# Altium schematic sheet AUAV_X05_CAM.SchDoc
size 209 x 148 mm
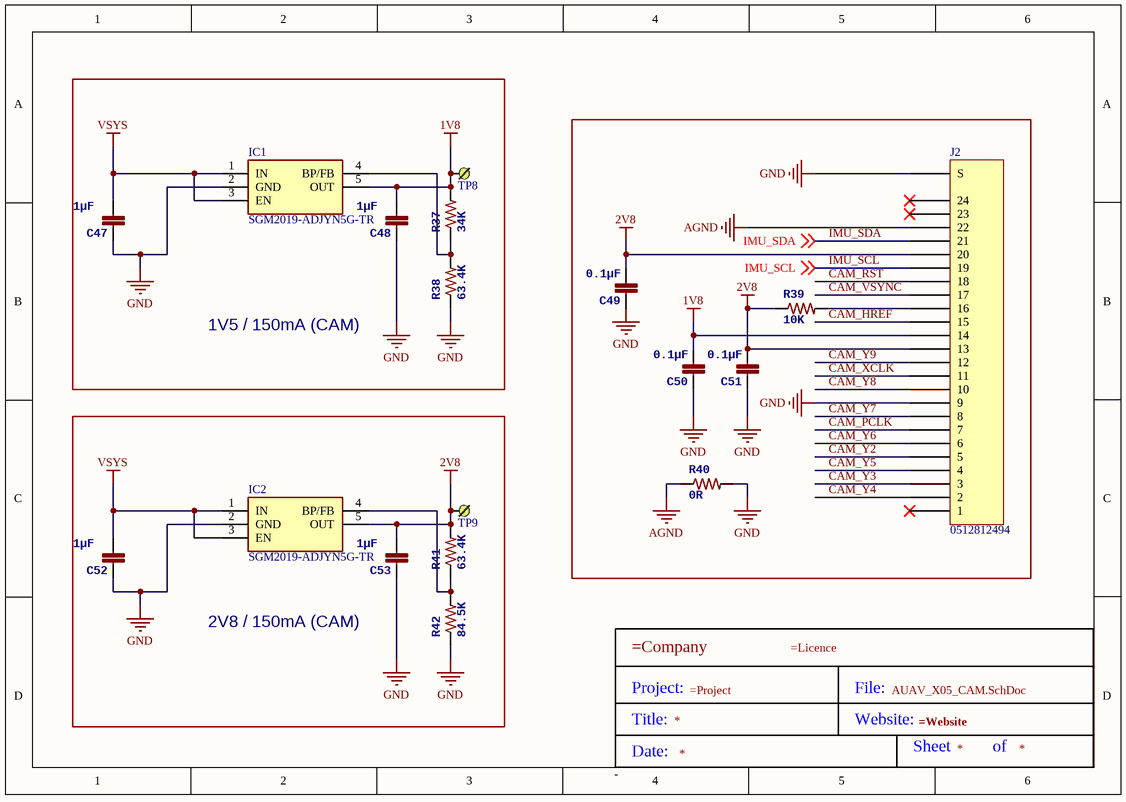
[diagram p0: AUAV_X05_CAM.SchDoc]

## Parts
*?  Title Block  (value not drawn)
C47  1µF  [0402-CAP]
C48  1µF  [0402-CAP]
C49  0.1µF  [0402-CAP]
C50  0.1µF  [0402-CAP]
C51  0.1µF  [0402-CAP]
C52  1µF  [0402-CAP]
C53  1µF  [0402-CAP]
IC1  SGM2019-ADJYN5G-TR  [SOT95P280X125-5N]
IC2  SGM2019-ADJYN5G-TR  [SOT95P280X125-5N]
J2  0512812494  [MOLEX 512812494]
R37  34K  [0402-RES]
R38  63.4K  [0402-RES]
R39  10K  [0402-RES]
R40  0R  [0402-RES]
R41  63.4K  [0402-RES]
R42  84.5K  [0402-RES]
TP8  TP  [SMT_PAD]  (value not drawn)
TP9  TP  [SMT_PAD]  (value not drawn)

## Blocks framed on the sheet
1V5 / 150mA (CAM): C47 C48 IC1 R37 R38 TP8
2V8 / 150mA (CAM): C52 C53 IC2 R41 R42 TP9

## Nets
1V8: C48.P$2 C50.P$2 IC1.5(OUT) J2.14 R37.P$2 TP8.1
2V8: C49.P$2 C51.P$2 C53.P$2 IC2.5(OUT) J2.13 J2.20 R39.P$1 R41.P$2 TP9.1
AGND: J2.22 R40.P$1
GND: C47.P$1 C48.P$1 C49.P$1 C50.P$1 C51.P$1 C52.P$1 C53.P$1 IC1.2(GND) IC2.2(GND) J2.9 J2.S R38.P$1 R40.P$2 R42.P$1
VSYS: C47.P$2 C52.P$2 IC1.1(IN) IC1.3(EN) IC2.1(IN) IC2.3(EN)
CAM_HREF: J2.15
CAM_PCLK: J2.7
CAM_RST: J2.18
CAM_VSYNC: J2.17
CAM_XCLK: J2.11
CAM_Y2: J2.5
CAM_Y3: J2.3
CAM_Y4: J2.2
CAM_Y5: J2.4
CAM_Y6: J2.6
CAM_Y7: J2.8
CAM_Y8: J2.10
CAM_Y9: J2.12
IMU_SCL: J2.19 ; off-sheet IMU_SCL
IMU_SDA: J2.21 ; off-sheet IMU_SDA
NetIC1_4: IC1.4(BP/FB) R37.P$1 R38.P$2
NetIC2_4: IC2.4(BP/FB) R41.P$1 R42.P$2
NetJ2_16: J2.16 R39.P$2

Not connected (* = marked no-connect by the designer): J2 1* 23* 24*

## Notes on the sheet
- (in symbol Title Block) Project:; File:; Title:; Website:; Sheet; of; Date:

## Library data of the parts
C47-C53 = CAP0402: CAP CER 8PF 50V C0G 0402; PARTNO: C1005C0G1H080C; 3DR_PARTNO: ECM0710; Value: 8p; Supplier 1: Digi-Key; Supplier Part Number 1: 445-4890-1-ND
IC1 IC2 = SGM2019-ADJYN5G-TR: Integrated Circuit; Manufacturer_Name: SGMICRO; Height: 1.25mm; Manufacturer_Part_Number: SGM2019-ADJYN5G-TR
J2 = 0512812494: CONN FFC FPC 24POS 0.50MM R/A; Manufacturer: Molex; Cable End Type: Straight, Tapered; Connector/Contact Type: Contacts, Top and Bottom; FFC, FCB Thickness: 0.30mm; Flat Flex Type: FFC, FPC; Material Flammability Rating: UL94 V-0; Number of Positions: 24; Pitch: 0.020" (0.50mm); Voltage Rating: 50V; Part Number: 0512812494; ComponentLink1Description: Datasheet; ComponentLink1URL: https://www.molex.com/pdm_docs/sd/512810794_sd.pdf; ComponentLink2Description: DigiKey Link; ComponentLink2URL: http://digikey.com/product-detail/en/molex/0512812494/WM6240CT-ND/2185198; Contact Finish: Gold; Contact Material: Phosphor Bronze; Features: Solder Retention; Height Above Board: 0.047" (1.20mm); Housing Material: Liquid Crystal Polymer (LCP), Glass Filled; LastUpdated: 26-05-2020 12:28:11; Lifecycle Status: Active; Minimum Order: 1; Mounting Type: Surface Mount, Right Angle; Operating Temperature: -20°C ~ 85°C; Packaging: TapeAndReel; Part Status: Active; Price: 0.71; Series: 51281; Supplier 1: DigiKey; Supplier Part Number 1: WM6240CT-ND; Termination: Solder
R37-R42 = RESISTOR0402-RES: RES 10K OHM 1/16W 1% 0402 SMD; PARTNO: RC0402FR-0710KL; 3DR_PARTNO: ECM0800; Supplier 1: Digi-Key; Value: 10K; Supplier Part Number 1: 311-10.0KLRCT-ND
*? = Title Block: Size: -